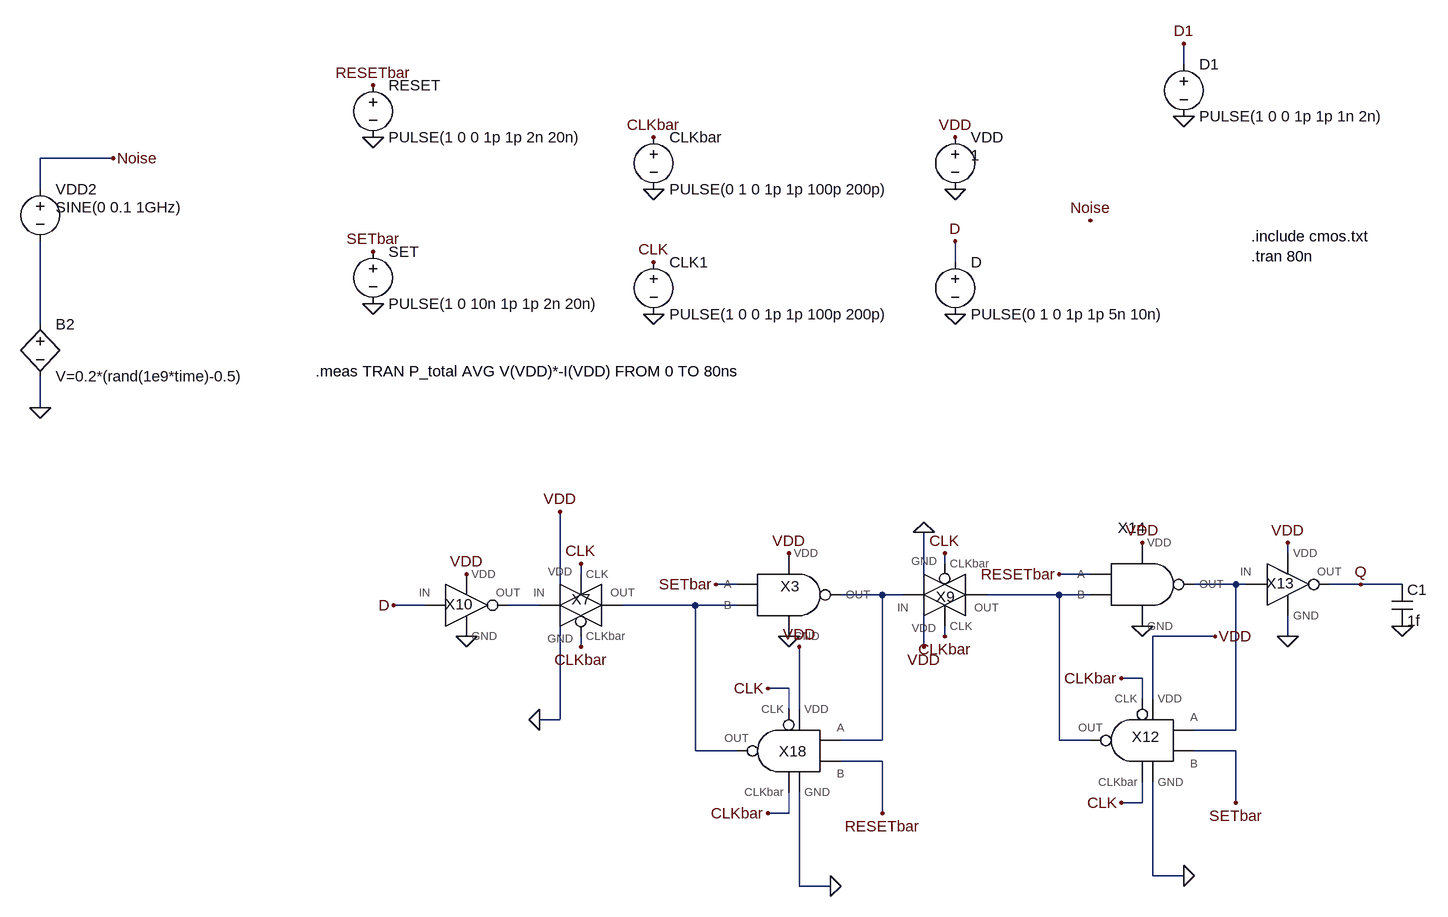
[diagram p0: schematic FFDTG.asc]
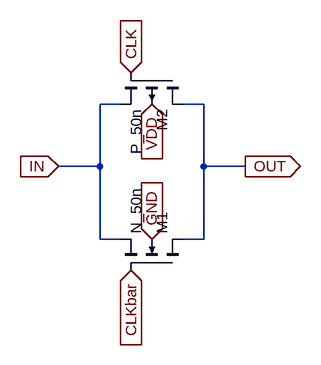
[diagram p1: sub-circuit tg.asc]
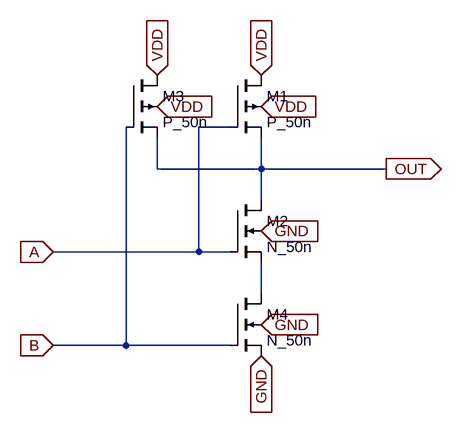
[diagram p2: sub-circuit nan2.asc]
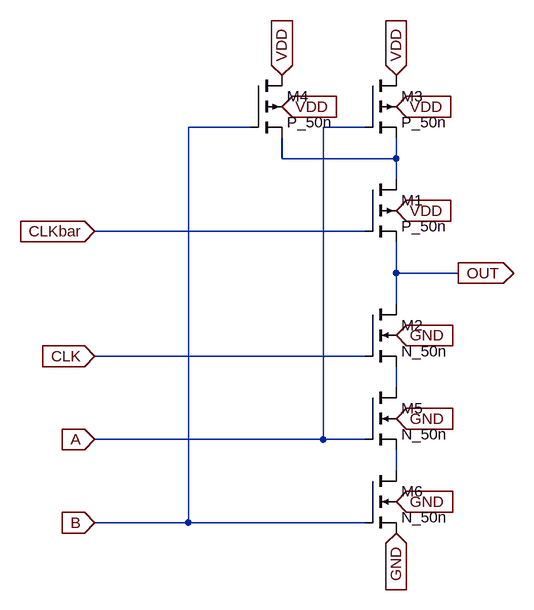
[diagram p3: sub-circuit tristatenand2.asc]
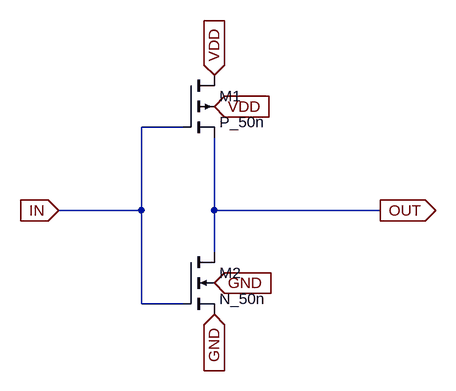
[diagram p4: sub-circuit inverter.asc]
FFDTG.asc, the LTspice schematic file:
Version 4.1
SHEET 1 3604 1884
WIRE 1472 -624 1472 -656
WIRE -176 -480 -288 -480
WIRE -288 -432 -288 -480
WIRE 1120 -320 1120 -352
WIRE -288 -224 -288 -352
WIRE -288 -96 -288 -144
WIRE 1632 128 1632 112
WIRE 1104 144 1104 128
WIRE 1408 144 1408 112
WIRE 544 160 544 144
WIRE 864 160 864 128
WIRE 1072 160 1072 96
WIRE 1328 160 1280 160
WIRE 512 176 512 64
WIRE 784 176 752 176
WIRE 1552 176 1488 176
WIRE 1568 176 1552 176
WIRE 1744 176 1696 176
WIRE 1808 176 1744 176
WIRE 1008 192 944 192
WIRE 1040 192 1008 192
WIRE 1280 192 1168 192
WIRE 1328 192 1280 192
WIRE 304 208 256 208
WIRE 480 208 432 208
WIRE 720 208 608 208
WIRE 784 208 720 208
WIRE 1104 256 1104 240
WIRE 1520 256 1424 256
WIRE 1632 256 1632 224
WIRE 544 272 544 256
WIRE 1072 272 1072 224
WIRE 1408 320 1376 320
WIRE 864 336 832 336
WIRE 1408 352 1408 320
WIRE 1424 352 1424 256
WIRE 864 368 864 336
WIRE 880 368 880 272
WIRE 512 384 512 240
WIRE 512 384 480 384
WIRE 1552 400 1552 176
WIRE 1552 400 1488 400
WIRE 1008 416 1008 192
WIRE 1008 416 944 416
WIRE 1280 416 1280 192
WIRE 1328 416 1280 416
WIRE 720 432 720 208
WIRE 784 432 720 432
WIRE 1552 432 1488 432
WIRE 1008 448 944 448
WIRE 1408 512 1408 480
WIRE 1408 512 1376 512
WIRE 1552 512 1552 432
WIRE 864 528 864 496
WIRE 864 528 832 528
WIRE 1008 528 1008 448
WIRE 1424 624 1424 480
WIRE 1472 624 1424 624
WIRE 880 640 880 496
WIRE 928 640 880 640
FLAG 1120 -352 D
FLAG 1120 -512 VDD
FLAG 224 -592 RESETbar
FLAG 224 -336 SETbar
FLAG 656 -320 CLK
FLAG 256 208 D
FLAG 512 64 VDD
FLAG 880 272 VDD
FLAG 864 128 VDD
FLAG 544 144 CLK
FLAG 544 272 CLKbar
FLAG 480 384 0
FLAG 928 640 0
FLAG 864 256 0
FLAG 1520 256 VDD
FLAG 1408 112 VDD
FLAG 1104 128 CLK
FLAG 1104 256 CLKbar
FLAG 1472 624 0
FLAG 1408 240 0
FLAG 1552 512 SETbar
FLAG 1280 160 RESETbar
FLAG 1072 272 VDD
FLAG 1072 96 0
FLAG 832 528 CLKbar
FLAG 832 336 CLK
FLAG 752 176 SETbar
FLAG 1008 528 RESETbar
FLAG 1376 512 CLK
FLAG 1376 320 CLKbar
FLAG 1632 112 VDD
FLAG 1632 256 0
FLAG 1744 176 Q
FLAG -288 -96 0
FLAG -176 -480 Noise
FLAG 224 -512 0
FLAG 224 -256 0
FLAG 656 -240 0
FLAG 656 -432 0
FLAG 1120 -432 0
FLAG 656 -512 CLKbar
FLAG 1328 -384 Noise
FLAG 1120 -240 0
FLAG 1472 -656 D1
FLAG 1472 -544 0
FLAG 368 256 0
FLAG 368 160 VDD
FLAG 1808 240 0
SYMBOL voltage 1120 -528 R0
WINDOW 123 0 0 Left 0
WINDOW 39 0 0 Left 0
WINDOW 3 24 44 Left 2
SYMATTR Value 1
SYMATTR InstName VDD
SYMBOL voltage 1120 -336 R0
WINDOW 123 0 0 Left 0
WINDOW 39 0 0 Left 0
SYMATTR InstName D
SYMATTR Value PULSE(0 1 0 1p 1p 5n 10n)
SYMBOL voltage 224 -608 R0
WINDOW 123 0 0 Left 0
WINDOW 39 0 0 Left 0
SYMATTR InstName RESET
SYMATTR Value PULSE(1 0 0 1p 1p 2n 20n)
SYMBOL voltage 224 -352 R0
WINDOW 123 0 0 Left 0
WINDOW 39 0 0 Left 0
SYMATTR InstName SET
SYMATTR Value PULSE(1 0 10n 1p 1p 2n 20n)
SYMBOL voltage 656 -528 R0
WINDOW 123 0 0 Left 0
WINDOW 39 0 0 Left 0
SYMATTR InstName CLKbar
SYMATTR Value PULSE(0 1 0 1p 1p 100p 200p)
SYMBOL voltage 656 -336 R0
WINDOW 123 0 0 Left 0
WINDOW 39 0 0 Left 0
SYMATTR InstName CLK1
SYMATTR Value PULSE(1 0 0 1p 1p 100p 200p)
SYMBOL Lib\\TG 544 208 R0
SYMATTR InstName X7
SYMBOL Lib\\NAN2 1392 176 R0
SYMATTR InstName X14
SYMBOL Lib\\TG 1104 192 M180
WINDOW 0 1 13 Bottom 2
SYMATTR InstName X9
SYMBOL Lib\\NAN2 848 192 R0
WINDOW 0 18 2 Bottom 2
SYMATTR InstName X3
SYMBOL Lib\\TristateNAND2 880 432 M0
WINDOW 0 10 16 Bottom 2
SYMATTR InstName X18
SYMBOL Lib\\TristateNAND2 1424 416 M0
WINDOW 0 11 10 Bottom 2
SYMATTR InstName X12
SYMBOL Lib\\Inverter 1632 176 R0
WINDOW 0 -12 14 Bottom 2
SYMATTR InstName X13
SYMBOL bv -288 -240 R0
SYMATTR InstName B2
SYMATTR Value V=0.2*(rand(1e9*time)-0.5)
SYMBOL voltage -288 -448 R0
WINDOW 123 0 0 Left 0
WINDOW 39 0 0 Left 0
WINDOW 3 24 44 Left 2
SYMATTR Value SINE(0 0.1 1GHz)
SYMATTR InstName VDD2
SYMBOL voltage 1472 -640 R0
WINDOW 123 0 0 Left 0
WINDOW 39 0 0 Left 0
SYMATTR InstName D1
SYMATTR Value PULSE(1 0 0 1p 1p 1n 2n)
SYMBOL Lib\\Inverter 368 208 R0
WINDOW 0 -12 14 Bottom 2
SYMATTR InstName X10
SYMBOL cap 1792 176 R0
SYMATTR InstName C1
SYMATTR Value 1f
TEXT 1576 -360 Left 2 !.include cmos.txt\n.tran 80n
TEXT 136 -152 Left 2 !.meas TRAN P_total AVG V(VDD)*-I(VDD) FROM 0 TO 80ns

tg.asc, the sub-circuit schematic file:
Version 4.1
SHEET 1 880 680
WIRE 400 112 368 112
WIRE 528 112 496 112
WIRE 368 208 368 112
WIRE 368 208 304 208
WIRE 528 208 528 112
WIRE 592 208 528 208
WIRE 368 320 368 208
WIRE 400 320 368 320
WIRE 528 320 528 208
WIRE 528 320 496 320
FLAG 448 112 VDD
IOPIN 448 112 In
FLAG 448 320 GND
IOPIN 448 320 In
FLAG 304 208 IN
IOPIN 304 208 In
FLAG 592 208 OUT
IOPIN 592 208 Out
FLAG 416 64 CLK
IOPIN 416 64 In
FLAG 416 368 CLKbar
IOPIN 416 368 In
SYMBOL nmos4 496 368 M270
SYMATTR InstName M1
SYMATTR Value2 l=50n w=2u
SYMATTR Value N_50n
SYMBOL pmos4 496 64 R90
SYMATTR InstName M2
SYMATTR Value2 l=50n w=6u
SYMATTR Value P_50n

nan2.asc, the sub-circuit schematic file:
Version 4.1
SHEET 1 880 680
WIRE 64 48 16 48
WIRE -48 112 -48 64
WIRE 112 112 112 64
WIRE 112 112 -48 112
WIRE 304 112 112 112
WIRE 112 160 112 112
WIRE 16 240 16 48
WIRE 16 240 -208 240
WIRE 64 240 16 240
WIRE 112 304 112 256
WIRE -96 384 -96 48
WIRE -96 384 -208 384
WIRE 64 384 -96 384
FLAG -48 -32 VDD
IOPIN -48 -32 In
FLAG -48 16 VDD
IOPIN -48 16 In
FLAG 112 16 VDD
IOPIN 112 16 In
FLAG 112 -32 VDD
IOPIN 112 -32 In
FLAG 112 352 GND
IOPIN 112 352 In
FLAG 112 400 GND
IOPIN 112 400 In
FLAG 112 208 GND
IOPIN 112 208 In
FLAG -208 240 A
IOPIN -208 240 In
FLAG -208 384 B
IOPIN -208 384 In
FLAG 304 112 OUT
IOPIN 304 112 Out
SYMBOL pmos4 64 -32 R0
SYMATTR InstName M1
SYMATTR Value P_50n
SYMATTR Value2 l=50n w=6u
SYMBOL nmos4 64 160 R0
SYMATTR InstName M2
SYMATTR Value N_50n
SYMATTR Value2 l=50n w=4u
SYMBOL pmos4 -96 -32 R0
SYMATTR InstName M3
SYMATTR Value P_50n
SYMATTR Value2 l=50n w=6u
SYMBOL nmos4 64 304 R0
SYMATTR InstName M4
SYMATTR Value N_50n
SYMATTR Value2 l=50n w=4u

tristatenand2.asc, the sub-circuit schematic file:
Version 4.1
SHEET 1 880 680
WIRE 96 -128 0 -128
WIRE 272 -128 208 -128
WIRE 144 -80 144 -112
WIRE 320 -80 320 -112
WIRE 320 -80 144 -80
WIRE 320 -48 320 -80
WIRE 272 32 -144 32
WIRE 320 96 320 48
WIRE 416 96 320 96
WIRE 320 144 320 96
WIRE 272 224 -144 224
WIRE 320 272 320 240
WIRE 208 352 208 -128
WIRE 208 352 -144 352
WIRE 272 352 208 352
WIRE 320 400 320 368
WIRE 0 480 0 -128
WIRE 0 480 -144 480
WIRE 272 480 0 480
FLAG 144 -208 VDD
IOPIN 144 -208 In
FLAG 144 -160 VDD
IOPIN 144 -160 In
FLAG 320 -160 VDD
IOPIN 320 -160 In
FLAG 320 -208 VDD
IOPIN 320 -208 In
FLAG 320 0 VDD
IOPIN 320 0 In
FLAG 416 96 OUT
IOPIN 416 96 Out
FLAG 320 192 GND
IOPIN 320 192 In
FLAG 320 320 GND
IOPIN 320 320 In
FLAG 320 448 GND
IOPIN 320 448 In
FLAG 320 496 GND
IOPIN 320 496 In
FLAG -144 480 B
IOPIN -144 480 In
FLAG -144 352 A
IOPIN -144 352 In
FLAG -144 224 CLK
IOPIN -144 224 In
FLAG -144 32 CLKbar
IOPIN -144 32 In
SYMBOL pmos4 272 -48 R0
SYMATTR InstName M1
SYMATTR Value2 l=50n w=12u
SYMATTR Value P_50n
SYMBOL nmos4 272 144 R0
SYMATTR InstName M2
SYMATTR Value2 l=50n w=6u
SYMATTR Value N_50n
SYMBOL pmos4 272 -208 R0
SYMATTR InstName M3
SYMATTR Value2 l=50n w=12u
SYMATTR Value P_50n
SYMBOL pmos4 96 -208 R0
SYMATTR InstName M4
SYMATTR Value2 l=50n w=12u
SYMATTR Value P_50n
SYMBOL nmos4 272 272 R0
SYMATTR InstName M5
SYMATTR Value2 l=50n w=6u
SYMATTR Value N_50n
SYMBOL nmos4 272 400 R0
SYMATTR InstName M6
SYMATTR Value2 l=50n w=6u
SYMATTR Value N_50n

inverter.asc, the sub-circuit schematic file:
Version 4.1
SHEET 1 880 680
WIRE 192 160 128 160
WIRE 128 288 128 160
WIRE 128 288 0 288
WIRE 240 288 240 176
WIRE 496 288 240 288
WIRE 240 352 240 288
WIRE 128 432 128 288
WIRE 192 432 128 432
FLAG 240 400 GND
IOPIN 240 400 In
FLAG 240 448 GND
IOPIN 240 448 In
FLAG 240 80 VDD
IOPIN 240 80 In
FLAG 240 128 VDD
IOPIN 240 128 In
FLAG 0 288 IN
IOPIN 0 288 In
FLAG 496 288 OUT
IOPIN 496 288 Out
SYMBOL pmos4 192 80 R0
SYMATTR InstName M1
SYMATTR Value P_50n
SYMATTR Value2 l=50n w=6u
SYMBOL nmos4 192 352 R0
SYMATTR InstName M2
SYMATTR Value N_50n
SYMATTR Value2 l=50n w=2u

The netlist it stands for:
* FFDTG.asc
VDD VDD 0 1
V§D D 0 PULSE(0 1 0 1p 1p 5n 10n)
V§RESET RESETbar 0 PULSE(1 0 0 1p 1p 2n 20n)
V§SET SETbar 0 PULSE(1 0 10n 1p 1p 2n 20n)
V§CLKbar CLKbar 0 PULSE(0 1 0 1p 1p 100p 200p)
V§CLK1 CLK 0 PULSE(1 0 0 1p 1p 100p 200p)
X§X7 CLK CLKbar 0 N005 VDD N006 tg
X§X14 RESETbar N004 0 VDD N002 nan2
X§X9 CLKbar CLK 0 N003 VDD N004 tg
X§X3 SETbar N006 0 VDD N003 nan2
X§X18 N003 RESETbar CLK CLKbar 0 VDD N006 tristatenand2
X§X12 N002 SETbar CLKbar CLK 0 VDD N004 tristatenand2
X§X13 0 N002 VDD Q inverter
B2 N001 0 V=0.2*(rand(1e9*time)-0.5)
VDD2 Noise N001 SINE(0 0.1 1GHz)
V§D1 D1 0 PULSE(1 0 0 1p 1p 1n 2n)
X§X10 0 D VDD N005 inverter
C1 Q 0 1f

* block symbol definitions
.subckt tg CLK CLKbar GND IN VDD OUT
M1 OUT CLKbar IN GND N_50n l=50n w=2u
M2 OUT CLK IN VDD P_50n l=50n w=6u
.ends tg

.subckt nan2 A B GND VDD OUT
M1 VDD A OUT VDD P_50n l=50n w=6u
M2 OUT A N001 GND N_50n l=50n w=4u
M3 VDD B OUT VDD P_50n l=50n w=6u
M4 N001 B GND GND N_50n l=50n w=4u
.ends nan2

.subckt tristatenand2 A B CLK CLKbar GND VDD OUT
M1 N001 CLKbar OUT VDD P_50n l=50n w=12u
M2 OUT CLK N002 GND N_50n l=50n w=6u
M3 VDD A N001 VDD P_50n l=50n w=12u
M4 VDD B N001 VDD P_50n l=50n w=12u
M5 N002 A N003 GND N_50n l=50n w=6u
M6 N003 B GND GND N_50n l=50n w=6u
.ends tristatenand2

.subckt inverter GND IN VDD OUT
M1 VDD IN OUT VDD P_50n l=50n w=6u
M2 OUT IN GND GND N_50n l=50n w=2u
.ends inverter

.model NMOS NMOS
.model PMOS PMOS
.lib standard.mos
.include cmos.txt
.tran 80n
.meas TRAN P_total AVG V(VDD)*-I(VDD) FROM 0 TO 80ns
.backanno
.end